# EAGLE design tssop28 (EAGLE 9.6.2)
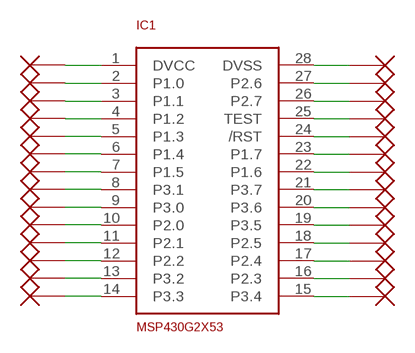
[diagram p0: schematic, sheet 1]

## Parts
IC1  MSP430G2X53  [TSSOP28]
P1  PIN  [PIN]
P2  PIN  [PIN]
P3  PIN  [PIN]
P4  PIN  [PIN]
P5  PIN  [PIN]
P6  PIN  [PIN]
P7  PIN  [PIN]
P8  PIN  [PIN]
P9  PIN  [PIN]
P10  PIN  [PIN]
P11  PIN  [PIN]
P12  PIN  [PIN]
P13  PIN  [PIN]
P14  PIN  [PIN]
P15  PIN  [PIN]
P16  PIN  [PIN]
P17  PIN  [PIN]
P18  PIN  [PIN]
P19  PIN  [PIN]
P20  PIN  [PIN]
P21  PIN  [PIN]
P22  PIN  [PIN]
P23  PIN  [PIN]
P24  PIN  [PIN]
P25  PIN  [PIN]
P26  PIN  [PIN]
P27  PIN  [PIN]
P28  PIN  [PIN]

## Nets
N$1: IC1.1(DVCC) P1.P$1
N$2: IC1.2(P1.0) P2.P$1
N$3: IC1.3(P1.1) P3.P$1
N$4: IC1.4(P1.2) P4.P$1
N$5: IC1.5(P1.3) P5.P$1
N$6: IC1.6(P1.4) P6.P$1
N$7: IC1.7(P1.5) P7.P$1
N$8: IC1.8(P3.1) P8.P$1
N$9: IC1.9(P3.0) P9.P$1
N$10: IC1.10(P2.0) P10.P$1
N$11: IC1.11(P2.1) P11.P$1
N$12: IC1.12(P2.2) P12.P$1
N$13: IC1.13(P3.2) P13.P$1
N$14: IC1.14(P3.3) P14.P$1
N$15: IC1.28(DVSS) P15.P$1
N$16: IC1.27(P2.6) P16.P$1
N$17: IC1.26(P2.7) P17.P$1
N$18: IC1.25(TEST) P18.P$1
N$19: IC1.24(/RST) P19.P$1
N$20: IC1.23(P1.7) P20.P$1
N$21: IC1.22(P1.6) P21.P$1
N$22: IC1.21(P3.7) P22.P$1
N$23: IC1.20(P3.6) P23.P$1
N$24: IC1.19(P3.5) P24.P$1
N$25: IC1.18(P2.5) P25.P$1
N$26: IC1.17(P2.4) P26.P$1
N$27: IC1.16(P2.3) P27.P$1
N$28: IC1.15(P3.4) P28.P$1

## Library data of the parts
IC1 = Microcontroller-MSP430:MSP430G2X53
P1-P28 = Mechanik:PIN

## Board
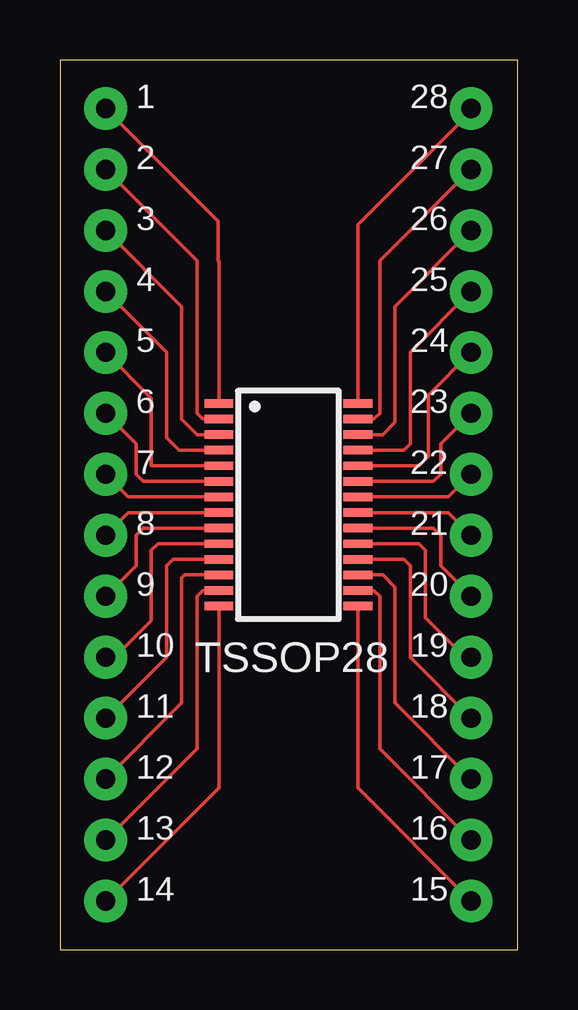
[diagram p1: board, top side]
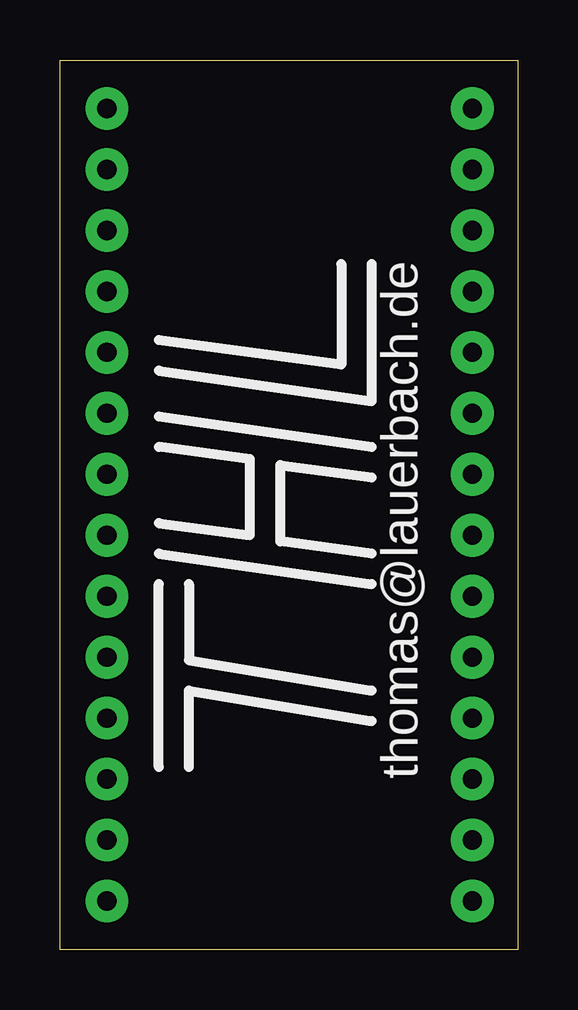
[diagram p2: board, bottom side, seen from below]

Size 19.1 x 37.07 mm. Coordinates in mm from the lower left corner, seen from the top.
Outline: 0,0 19.1,0 19.1,37.07 0,37.07 0,0
Copper layers (1*16): Top 0.035mm / dielectric 1.5mm / Bottom 0.035mm
Design rules "default": minimum track width 6mil, minimum drill 0.35mm, track to track 6mil, track to pad 6mil, pad to pad 6mil, via to via 6mil, smd to smd 6mil, copper to edge 40mil, drill to drill 6mil, minimum pad ring 10mil, minimum via ring 8mil, stop-mask expansion 4mil, vias tented up to drill 0mil, thermal gap 10mil

### Footprints (pad centres in the part's own frame; a part is rotated, then mirrored left to right if it is on the bottom)
TSSOP28 = smd 0.35 x 1.2: 1 -4.225,-2.9; 2 -3.575,-2.9; 3 -2.925,-2.9; 4 -2.275,-2.9; 5 -1.625,-2.9; 6 -0.975,-2.9; 7 -0.325,-2.9; 8 0.325,-2.9; 9 0.975,-2.9; 10 1.625,-2.9; 11 2.275,-2.9; 12 2.925,-2.9; 13 3.575,-2.9; 14 4.225,-2.9; 15 4.225,2.9; 16 3.575,2.9; 17 2.925,2.9; 18 2.275,2.9; 19 1.625,2.9; 20 0.975,2.9; 21 0.325,2.9; 22 -0.325,2.9; 23 -0.975,2.9; 24 -1.625,2.9; 25 -2.275,2.9; 26 -2.925,2.9; 27 -3.575,2.9; 28 -4.225,2.9
PIN = drill 0.8 pad 1.778: P$1 0,0

### Placement (x,y rotation side)
IC1  9.53,18.54 270 top
P1  1.91,35.05 0 top
P2  1.91,32.51 0 top
P3  1.91,29.97 0 top
P4  1.91,27.43 0 top
P5  1.91,24.89 0 top
P6  1.91,22.35 0 top
P7  1.91,19.81 0 top
P8  1.91,17.27 0 top
P9  1.91,14.73 0 top
P10  1.91,12.19 0 top
P11  1.91,9.65 0 top
P12  1.91,7.11 0 top
P13  1.91,4.57 0 top
P14  1.91,2.03 0 top
P15  17.14,35.05 0 top
P16  17.14,32.51 0 top
P17  17.14,29.97 0 top
P18  17.14,27.43 0 top
P19  17.14,24.89 0 top
P20  17.14,22.35 0 top
P21  17.14,19.81 0 top
P22  17.14,17.27 0 top
P23  17.14,14.73 0 top
P24  17.14,12.19 0 top
P25  17.14,9.65 0 top
P26  17.14,7.11 0 top
P27  17.14,4.57 0 top
P28  17.14,2.03 0 top
U$1  [THL]  9.91,17.78 90 bottom

### Tracks (layer width: path | path; a pad name or v marks a point on that pad's centre or on a via)
N$1
  Top 0.152: IC1.1 6.62,28.68 6.6,28.7 6.6,30.35 P1.P$1
N$2
  Top 0.152: IC1.2 5.95,22.12 5.71,22.35 5.71,28.7 P2.P$1
N$3
  Top 0.152: IC1.3 5.72,21.47 5.71,21.46 5.08,22.1 5.08,26.8 P3.P$1
N$4
  Top 0.152: IC1.4 4.96,20.82 4.45,21.34 4.45,24.89 P4.P$1
N$5
  Top 0.152: IC1.5 3.84,20.17 3.81,20.19 3.81,22.99 P5.P$1
N$6
  Top 0.152: IC1.6 3.47,19.52 3.17,19.81 3.17,21.08 P6.P$1
N$7
  Top 0.152: IC1.7 2.85,18.87 P7.P$1
N$8
  Top 0.152: IC1.8 2.85,18.22 P8.P$1
N$9
  Top 0.152: IC1.9 3.47,17.57 3.17,17.27 3.17,16 P9.P$1
N$10
  Top 0.152: IC1.10 4.09,16.92 3.81,16.64 3.81,13.72 2.29,12.19 P10.P$1
N$11
  Top 0.152: IC1.11 4.71,16.27 4.45,16 4.45,12.19 P11.P$1
N$12
  Top 0.152: IC1.12 5.2,15.62 5.08,15.49 5.08,10.29 P12.P$1
N$13
  Top 0.152: IC1.13 5.95,14.97 5.71,14.73 5.71,8.38 P13.P$1
N$14
  Top 0.152: IC1.14 6.62,6.75 P14.P$1
N$15
  Top 0.152: IC1.28 12.43,30.21 17.14,34.92 P15.P$1
N$16
  Top 0.152: IC1.27 13.1,22.12 13.34,22.35 13.34,28.7 P16.P$1
N$17
  Top 0.152: IC1.26 13.47,21.47 13.97,21.97 13.97,26.8 P17.P$1
N$18
  Top 0.152: IC1.25 14.34,20.82 14.61,21.08 14.61,24.89 P18.P$1
N$19
  Top 0.152: IC1.24 14.96,20.17 15.37,20.57 15.37,23.11 P19.P$1
N$20
  Top 0.152: IC1.23 15.58,19.52 15.88,19.81 15.88,21.08 P20.P$1
N$21
  Top 0.152: IC1.22 16.2,18.87 P21.P$1
N$22
  Top 0.152: IC1.21 16.2,18.22 P22.P$1
N$23
  Top 0.152: IC1.20 15.58,17.57 15.88,17.27 15.88,16 P23.P$1
N$24
  Top 0.152: IC1.19 14.96,16.92 15.24,16.64 15.24,13.84 16.89,12.19 P24.P$1
N$25
  Top 0.152: IC1.18 14.34,16.27 14.61,16 14.61,12.19 P25.P$1
N$26
  Top 0.152: IC1.17 13.47,15.62 13.97,15.11 13.97,10.29 P26.P$1
N$27
  Top 0.152: IC1.16 13.1,14.97 13.34,14.73 13.34,8.38 P27.P$1
N$28
  Top 0.152: IC1.15 12.43,6.75 P28.P$1

### Text on the board
tNames: 1 | 28 | 2 | 27 | 3 | 26 | 4 | 25 | 5 | 24 | 6 | 23 | 7 | 22 | 8 | 21 | 9 | 20 | 10 | TSSOP28 | 19 | 11 | 18 | 12 | 17 | 13 | 16 | 14 | 15
bNames: thomas@lauerbach.de